# EAGLE design grizzly_bear (EAGLE 6.2)
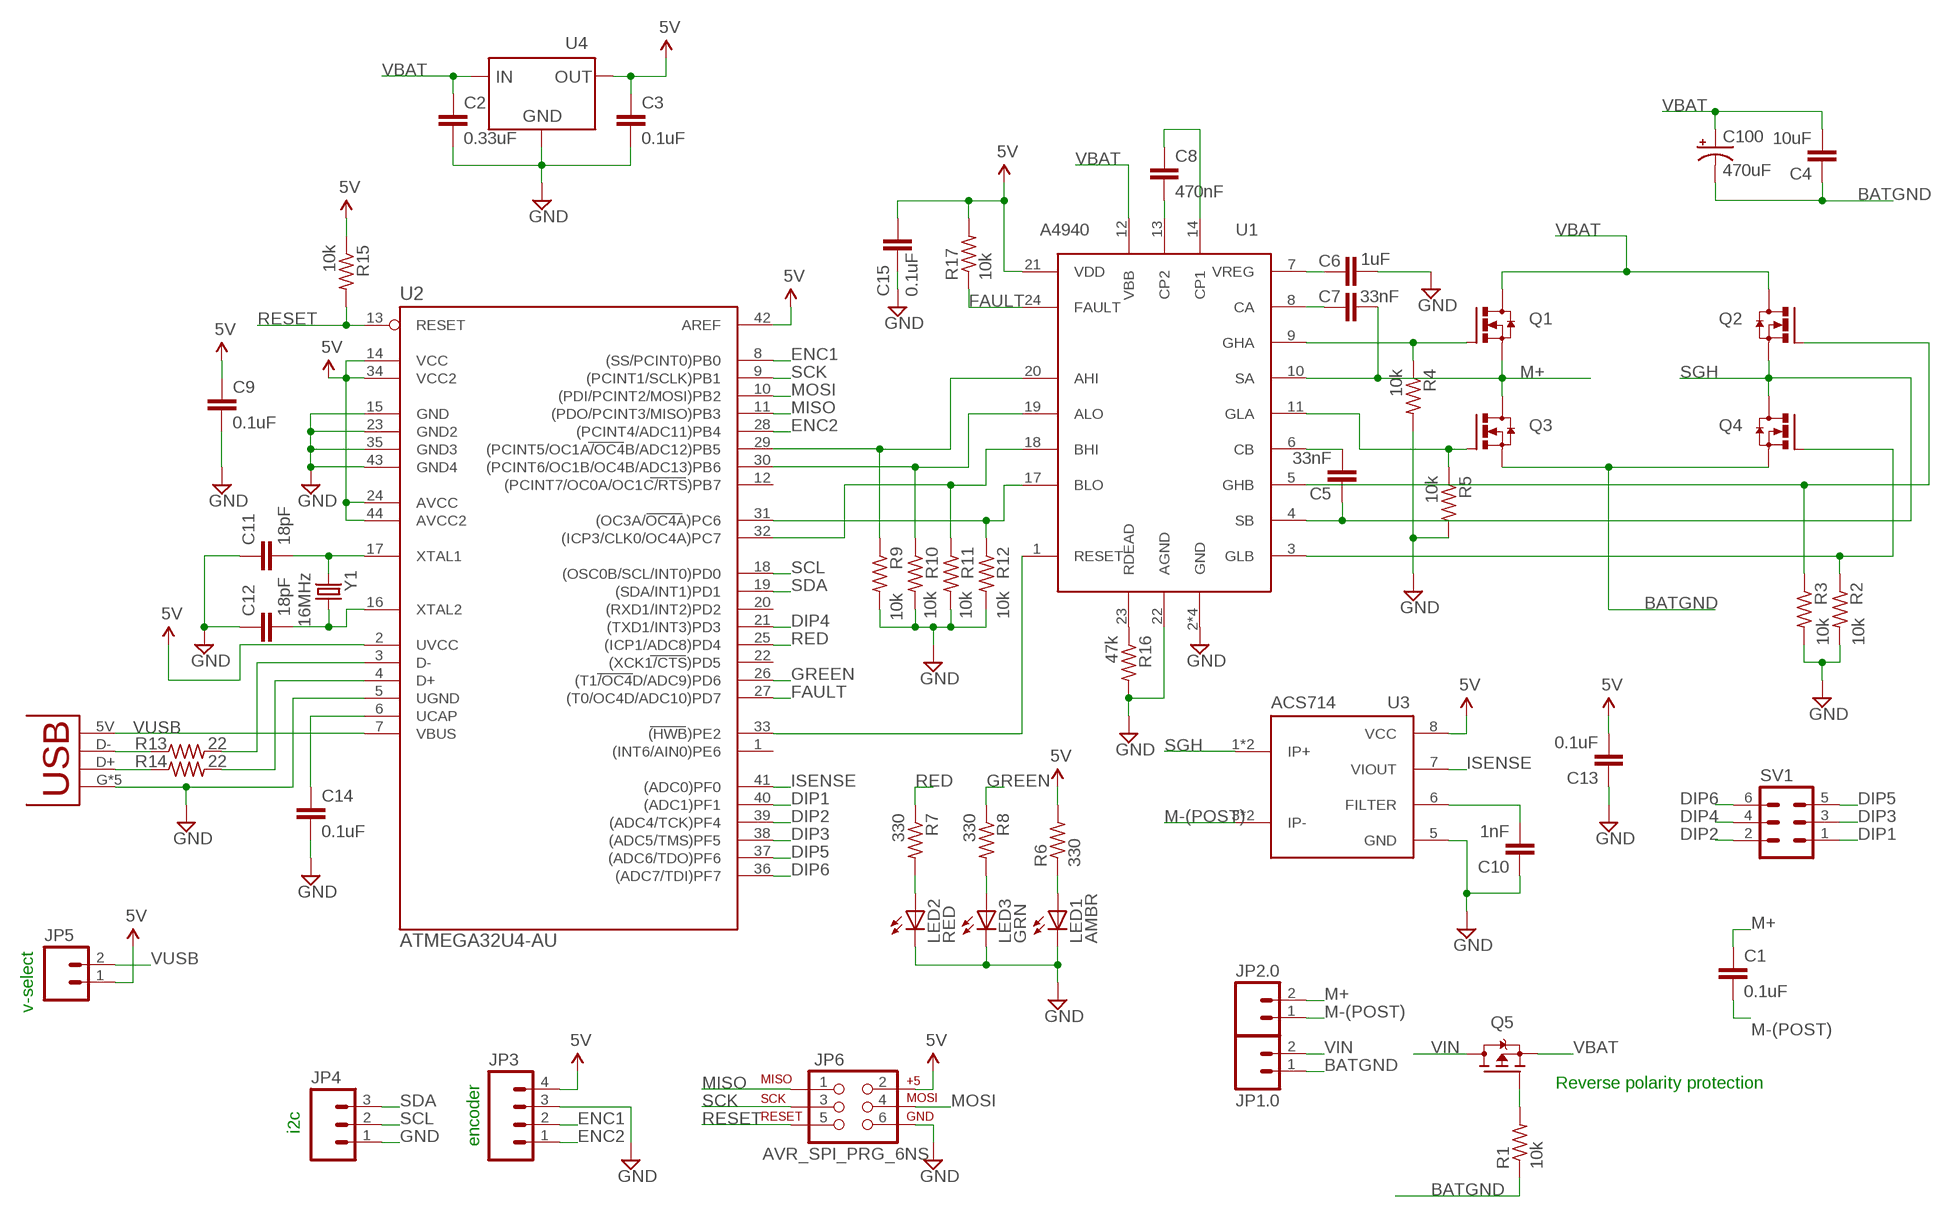
[diagram p0: schematic, sheet 1]

## Parts
C1  0.1uF  CAP0603-CAP  [0603-CAP]
C2  0.33uF  CAP0603-CAP  [0603-CAP]
C3  0.1uF  CAP0603-CAP  [0603-CAP]
C4  10uF  CAP0603-CAP  [0603-CAP]
C5  33nF  CAP0603-CAP  [0603-CAP]
C6  1uF  CAP0603-CAP  [0603-CAP]
C7  33nF  CAP0603-CAP  [0603-CAP]
C8  470nF  CAP0603-CAP  [0603-CAP]
C9  0.1uF  CAP0603-CAP  [0603-CAP]
C10  1nF  CAP0603-CAP  [0603-CAP]
C11  18pF  CAP0603-CAP  [0603-CAP]
C12  18pF  CAP0603-CAP  [0603-CAP]
C13  0.1uF  CAP0603-CAP  [0603-CAP]
C14  0.1uF  CAP0603-CAP  [0603-CAP]
C15  0.1uF  CAP0603-CAP  [0603-CAP]
C100  470uF  CAP_POLG  [PANASONIC_G]
JP1.0  M02PTH4  [1X02_XTRA_BIG]
JP2.0  M02PTH4  [1X02_XTRA_BIG]
JP3  M04POLAR  [MOLEX-1X4]
JP4  M03POLAR  [MOLEX-1X3]
JP5  M02LOCK  [1X02_LOCK]
JP6  AVR_SPI_PRG_6NS  [2X3-NS]
LED1  AMBR  LED1206  [LED-1206]
LED2  RED  LED1206  [LED-1206]
LED3  GRN  LED1206  [LED-1206]
Q1  N-CHANNEL-MOSFET  [SOT669]
Q2  N-CHANNEL-MOSFET  [SOT669]
Q3  N-CHANNEL-MOSFET  [SOT669]
Q4  N-CHANNEL-MOSFET  [SOT669]
Q5  IPD90P03P4L  P-CHANNEL-MOSFETTO252  [TO252]
R1  10k  R-US_R0603  [R0603]
R2  10k  R-US_R0603  [R0603]
R3  10k  R-US_R0603  [R0603]
R4  10k  R-US_R0603  [R0603]
R5  10k  R-US_R0603  [R0603]
R6  330  R-US_R0603  [R0603]
R7  330  R-US_R0603  [R0603]
R8  330  R-US_R0603  [R0603]
R9  10k  R-US_R0603  [R0603]
R10  10k  R-US_R0603  [R0603]
R11  10k  R-US_R0603  [R0603]
R12  10k  R-US_R0603  [R0603]
R13  22  R-US_R0603  [R0603]
R14  22  R-US_R0603  [R0603]
R15  10k  R-US_R0603  [R0603]
R16  47k  R-US_R0603  [R0603]
R17  10k  R-US_R0603  [R0603]
SV1  MA03-2  [MA03-2]
U1  A4940  [24-PIN_TSSOP]
U2  ATMEGA32U4-AU  [TQFP44]
U3  ACS714  [8-PIN_SOIC]
U4  UA78L00  [SOT-89-3]
U$2  USB-M26FTR  [USB-M26FTR]
Y1  16MHz  CRYSTALHC49US  [HC49US]

## Nets
5V: C3.1 C9.1 C13.2 C15.1 JP3.4 JP5.1 JP6.2 R6.2 R15.1 R17.2 U1.21(VDD) U2.2(UVCC) U2.14(VCC) U2.24(AVCC) U2.34(VCC2) U2.42(AREF) U2.44(AVCC2) U3.8(VCC) U4.OUTPUT(OUT)
AHI: R9.1 U1.20(AHI) U2.29((PCINT5/OC1A/OC4B/ADC12)PB5)
BATGND: C4.1 C100.- JP1.0.1 Q3.1(S) Q3.2(S) Q3.3(S) Q4.1(S) Q4.2(S) Q4.3(S) R1.1
DIP1: SV1.1 U2.40((ADC1)PF1)
DIP2: SV1.2 U2.39((ADC4/TCK)PF4)
DIP3: SV1.3 U2.38((ADC5/TMS)PF5)
DIP4: SV1.4 U2.21((TXD1/INT3)PD3)
DIP5: SV1.5 U2.37((ADC6/TDO)PF6)
DIP6: SV1.6 U2.36((ADC7/TDI)PF7)
ENC1: JP3.2 U2.8((SS/PCINT0)PB0)
ENC2: JP3.1 U2.28((PCINT4/ADC11)PB4)
FAULT: R17.1 U1.24(FAULT) U2.27((T0/OC4D/ADC10)PD7)
GND: C2.2 C3.2 C6.2 C9.2 C10.1 C11.1 C12.1 C13.1 C14.2 C15.2 JP3.3 JP4.1 JP6.6 LED1.C LED2.C LED3.C R2.2 R3.2 R4.2 R5.2 R9.2 R10.2 R11.2 R12.2 R16.2 U1.2(GND) U1.15(GND) U1.16(GND) U1.22(AGND) U1.PAD(GND) U2.5(UGND) U2.15(GND) U2.23(GND2) U2.35(GND3) U2.43(GND4) U3.5(GND) U4.COMMON(GND) U$2.G U$2.S1(G) U$2.S2(G) U$2.S3(G) U$2.S4(G)
GREEN: R8.1 U2.26((T1/OC4D/ADC9)PD6)
ISENSE: U2.41((ADC0)PF0) U3.7(VIOUT)
M+: C1.1 C7.2 JP2.0.2 Q1.1(S) Q1.2(S) Q1.3(S) Q3.MB(D) U1.10(SA)
M-(POST): C1.2 JP2.0.1 U3.3(IP-) U3.4(IP-)
MISO: JP6.1 U2.11((PDO/PCINT3/MISO)PB3)
MOSI: JP6.4 U2.10((PDI/PCINT2/MOSI)PB2)
N$1: Q5.1(G) R1.2
N$2: Q1.4(G) R4.1 U1.9(GHA)
N$3: C8.2 U1.13(CP2)
N$5: LED3.A R8.2
N$6: R16.1 U1.23(RDEAD)
N$7: R13.2 U2.3(D-)
N$8: Q3.4(G) R5.1 U1.11(GLA)
N$9: R14.2 U2.4(D+)
N$10: U1.1(RESET) U2.33((HWB)PE2)
N$11: Q4.4(G) R2.1 U1.3(GLB)
N$13: Q2.4(G) R3.1 U1.5(GHB)
N$14: C5.2 U1.6(CB)
N$16: C7.1 U1.8(CA)
N$17: C6.1 U1.7(VREG)
N$18: C14.1 U2.6(UCAP)
N$19: C8.1 U1.14(CP1)
N$20: R12.1 U1.17(BLO) U2.31((OC3A/OC4A)PC6)
N$21: R11.1 U1.18(BHI) U2.32((ICP3/CLK0/OC4A)PC7)
N$22: R10.1 U1.19(ALO) U2.30((PCINT6/OC1B/OC4B/ADC13)PB6)
N$23: LED2.A R7.2
N$24: R14.1 U$2.D+
N$25: LED1.A R6.1
N$26: C11.2 U2.17(XTAL1) Y1.2
N$27: C12.2 U2.16(XTAL2) Y1.1
N$28: C10.2 U3.6(FILTER)
N$29: R13.1 U$2.D-
RED: R7.1 U2.25((ICP1/ADC8)PD4)
RESET: JP6.5 R15.2 U2.13(RESET)
SCK: JP6.3 U2.9((PCINT1/SCLK)PB1)
SCL: JP4.2 U2.18((OSC0B/SCL/INT0)PD0)
SDA: JP4.3 U2.19((SDA/INT1)PD1)
SGH: C5.1 Q2.1(S) Q2.2(S) Q2.3(S) Q4.MB(D) U1.4(SB) U3.1(IP+) U3.2(IP+)
VBAT: C2.1 C4.2 C100.+ Q1.MB(D) Q2.MB(D) Q5.2(S) U1.12(VBB) U4.INPUT(IN)
VIN: JP1.0.2 Q5.3(D)
VUSB: JP5.2 U2.7(VBUS) U$2.5V
Unconnected: U2.1((INT6/AIN0)PE6) U2.12((PCINT7/OC0A/OC1C/RTS)PB7) U2.20((RXD1/INT2)PD2) U2.22((XCK1/CTS)PD5)

## Notes on the sheet
- v-select
- Reverse polarity protection
- i2c
- encoder

## Library data of the parts
C1-C15 = pie:CAP: Capacitor Standard 0603 ceramic capacitor, and 0.1" leaded capacitor.
C100 = pie:CAP_POL: Capacitor Polarized These are standard SMD and PTH capacitors. Normally 10uF, 47uF, and 100uF in electrolytic and tantalum varieties. Always verify the external diameter of the through hole cap, it varies with capacity, voltage, and manufacturer. The EIA devices should be standard.
JP1.0 JP2.0 JP5 = pie:M02: Header 2 Standard 2-pin 0.1" header. Use with straight break away headers (SKU : PRT-00116), right angle break away headers (PRT-00553), swiss pins (PRT-00743), machine pins (PRT-00117), and female headers (PRT-00115). Molex polarized connector foot print use with SKU : PRT-08233 with associated crimp pins and housings.
JP3 = pie:M04: Header 4 Standard 4-pin 0.1" header. Use with straight break away headers (SKU : PRT-00116), right angle break away headers (PRT-00553), swiss pins (PRT-00743), machine pins (PRT-00117), and female headers (PRT-00115). Molex polarized connector foot print use with SKU : PRT-08231 with associated crimp pins and housings. 1MM SMD Version SKU: PRT-10208
JP4 = pie:M03: Header 3 Standard 3-pin 0.1" header. Use with straight break away headers (SKU : PRT-00116), right angle break away headers (PRT-00553), swiss pins (PRT-00743), machine pins (PRT-00117), and female headers (PRT-00115). Molex polarized connector foot print use with SKU : PRT-08232 with associated crimp pins and housings.
JP6 = pie:AVR_SPI_PRG_6: AVR ISP 6 Pin This is the reduced ISP connector for AVR programming. Common on Arduino. This footprint will take up less PCB space and can be used with a 10-pin to 6-pin adapter such as SKU: BOB-08508
LED1-LED3 = pie:LED: LEDs Standard schematic elements and footprints for 5mm, 3mm, 1206, and 0603 sized LEDs. 5mm - Spark Fun Electronics SKU : COM-00529 (and others)
Q1-Q4 = pie:N-CHANNEL-MOSFET: N-channel TrenchMOS (TM) logic level FET Source: http://www.nxp.com/acrobat_download/datasheets/PH7030L_4.pdf; PIE-DIGIKEY-PN-PRI: 568-6738-1-ND
Q5 = pie:P-CHANNEL-MOSFET: P-Channel PowerTrench® MOSFET Source: FDD4141.pdf; PIE-DIGIKEY-PN-PRI: IPD90P03P4L-04INCT-ND
R1-R17 = pie:R-US_: RESISTOR, American symbol
SV1 = pie:MA03-2: PIN HEADER; OC_FARNELL: unknown; OC_NEWARK: unknown
U1 = pie:A4940; PIE-DIGIKEY-PN-PRI: 620-1319-1-ND
U2 = pie:ATMEGA32U4-AU; PIE-DIGIKEY-PN-ALT1: ATMEGA32U4-MURCT-ND; PIE-DIGIKEY-PN-PRI: ATMEGA32U4RC-MURCT-ND
U3 = pie:ACS714; PIE-DIGIKEY-PN-PRI: 620-1260-1-ND
U4 = pie:UA78L00; PIE-DIGIKEY-PN-PRI: 296-11118-1-ND
U$2 = pie:USB-M26FTR
Y1 = pie:CRYSTAL: Various standard crystals. Proven footprints. Spark Fun Electronics SKU : COM-00534

## Board
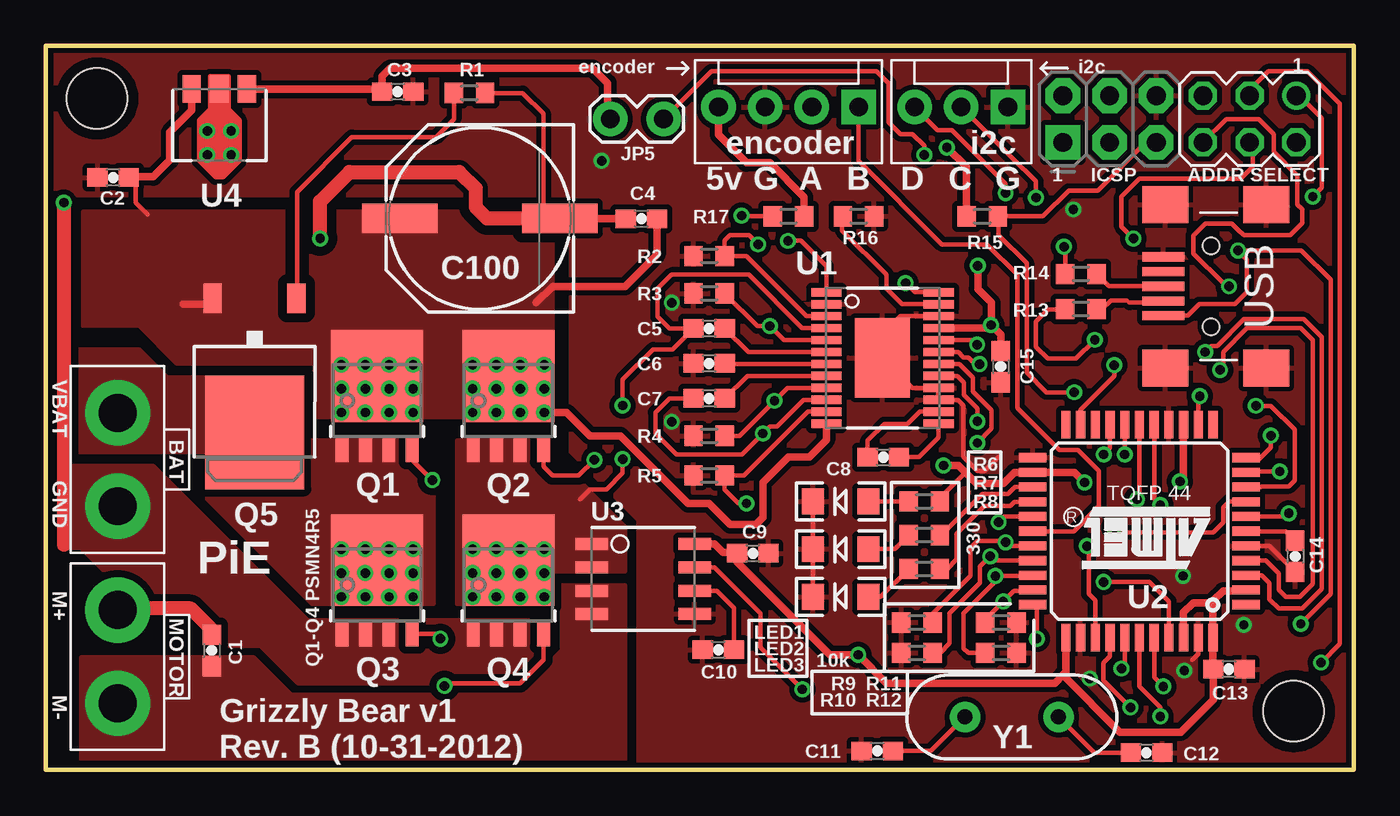
[diagram p1: board, top side]
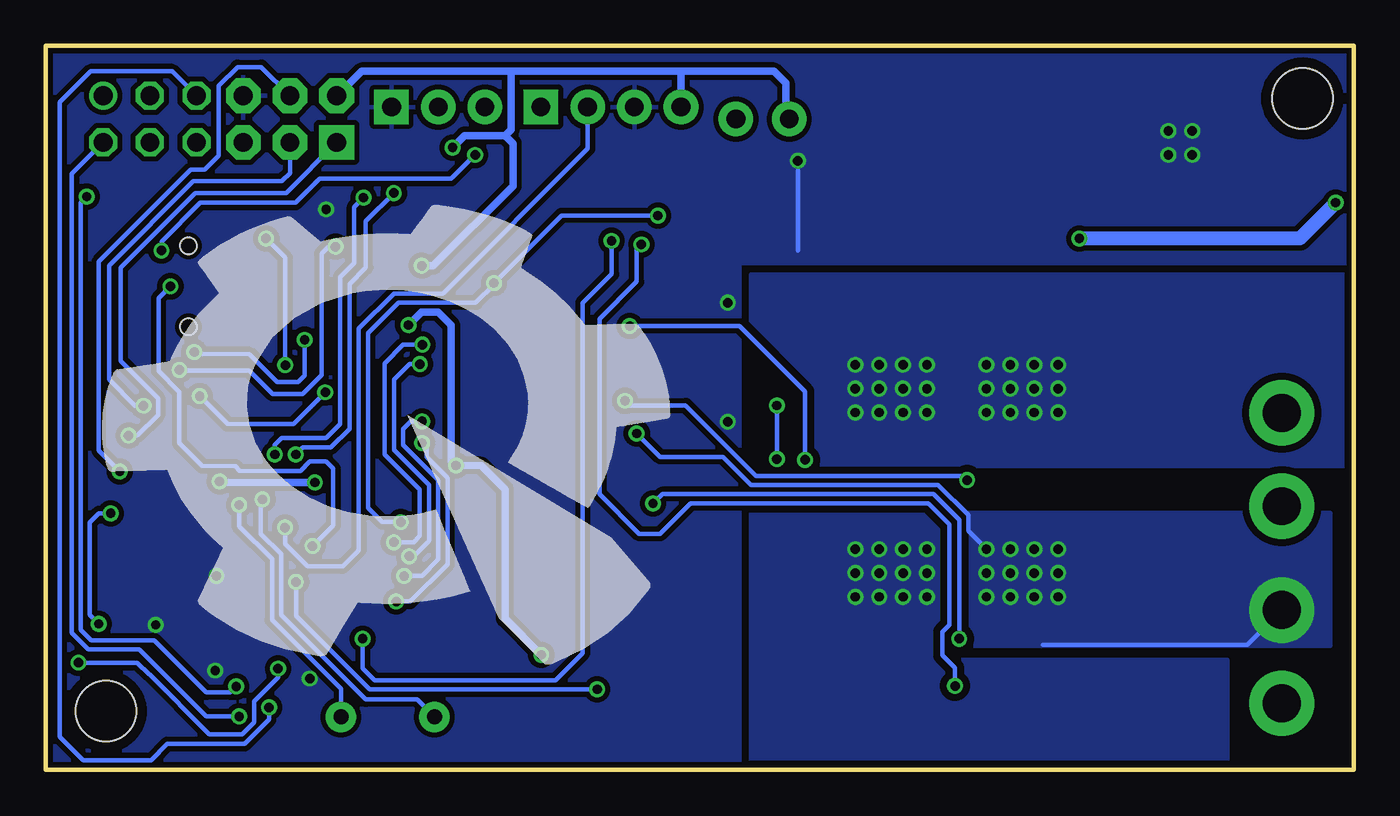
[diagram p2: board, bottom side, seen from below]

Size 71.12 x 39.37 mm. Coordinates in mm from the lower left corner, seen from the top.
Outline: 0,0 71.12,0 71.12,39.37 0,39.37 0,0
Copper layers (1*16): Top 2mil / dielectric 9mil / Bottom 2mil
Design rules: minimum track width 6mil, minimum drill 15mil, track to track 6mil, track to pad 10mil, pad to pad 6mil, via to via 6mil, smd to smd 6mil, copper to edge 10mil, drill to drill 7mil, minimum pad ring 7mil, minimum via ring 7mil, stop-mask expansion 3mil, vias tented up to drill 0mil, thermal gap 10mil

### Footprints (pad centres in the part's own frame; a part is rotated, then mirrored left to right if it is on the bottom)
0603-CAP = smd 1.1 x 1: 1 -0.85,0; 2 0.85,0
PANASONIC_G = smd 4.1 x 1.6: + 4.35,0; - -4.35,0
1X02_XTRA_BIG = drill 2.057 pad 3.556: 1 -2.54,0; 2 2.54,0
MOLEX-1X4 = drill 1.016 pad 1.88 square: 1 0,0 | drill 1.016 pad 1.88: 2 2.54,0; 3 5.08,0; 4 7.62,0
MOLEX-1X3 = drill 1.016 pad 1.88 square: 1 0,0 | drill 1.016 pad 1.88: 2 2.54,0; 3 5.08,0
1X02_LOCK = drill 1.016 pad 1.88: 1 -0.178,0; 2 2.718,0
2X3-NS = drill 1.016 pad 1.88 square: 1 -2.54,-1.27 | drill 1.016 pad 1.88 octagon: 2 -2.54,1.27; 3 0,-1.27; 4 0,1.27; 5 2.54,-1.27; 6 2.54,1.27
LED-1206 = smd 1.2 x 1.4: A -1.5,0; C 1.5,0
SOT669 = smd 0.7 x 1.4: 1 -1.905,-2.65; 2 -0.635,-2.65; 3 0.635,-2.65; 4 1.905,-2.65 | smd 5 x 5: MB 0,1.35
TO252 = smd 1 x 1.6: 1 -2.28,-4.8; 2 2.28,-4.8 | smd 5.4 x 6.2: 3 0,2.5
R0603 = smd 1 x 1.1: 1 -0.85,0; 2 0.85,0
MA03-2 = drill 1.016: 1 -2.54,-1.27 | drill 1.016 octagon: 2 -2.54,1.27; 3 0,-1.27; 4 0,1.27; 5 2.54,-1.27; 6 2.54,1.27
24-PIN_TSSOP = smd 1.65 x 0.45: 1 -3.05,3.575; 2 -3.05,2.925; 3 -3.05,2.275; 4 -3.05,1.625; 5 -3.05,0.975; 6 -3.05,0.325; 7 -3.05,-0.325; 8 -3.05,-0.975; 9 -3.05,-1.625; 10 -3.05,-2.275; 11 -3.05,-2.925; 12 -3.05,-3.575; 13 3.05,-3.575; 14 3.05,-2.925; 15 3.05,-2.275; 16 3.05,-1.625; 17 3.05,-0.975; 18 3.05,-0.325; 19 3.05,0.325; 20 3.05,0.975; 21 3.05,1.625; 22 3.05,2.275; 23 3.05,2.925; 24 3.05,3.575 | smd 3 x 4.32: PAD 0,0
TQFP44 = smd 1.5 x 0.5: 1 -5.8,4; 2 -5.8,3.2; 3 -5.8,2.4; 4 -5.8,1.6; 5 -5.8,0.8; 6 -5.8,0; 7 -5.8,-0.8; 8 -5.8,-1.6; 9 -5.8,-2.4; 10 -5.8,-3.2; 11 -5.8,-4; 23 5.8,-4; 24 5.8,-3.2; 25 5.8,-2.4; 26 5.8,-1.6; 27 5.8,-0.8; 28 5.8,0; 29 5.8,0.8; 30 5.8,1.6; 31 5.8,2.4; 32 5.8,3.2; 33 5.8,4 | smd 0.5 x 1.5: 12 -4,-5.8; 13 -3.2,-5.8; 14 -2.4,-5.8; 15 -1.6,-5.8; 16 -0.8,-5.8; 17 0,-5.8; 18 0.8,-5.8; 19 1.6,-5.8; 20 2.4,-5.8; 21 3.2,-5.8; 22 4,-5.8; 34 4,5.8; 35 3.2,5.8; 36 2.4,5.8; 37 1.6,5.8; 38 0.8,5.8; 39 0,5.8; 40 -0.8,5.8; 41 -1.6,5.8; 42 -2.4,5.8; 43 -3.2,5.8; 44 -4,5.8
8-PIN_SOIC = smd 1.75 x 0.65: 1 -2.8,1.905; 2 -2.8,0.635; 3 -2.8,-0.635; 4 -2.8,-1.905; 5 2.8,-1.905; 6 2.8,-0.635; 7 2.8,0.635; 8 2.8,1.905
SOT-89-3 = smd 1 x 1.5: COMMON 0,-3.9; INPUT 1.5,-3.9; OUTPUT -1.5,-3.9
USB-M26FTR = smd 0.5 x 2.3: 5V -1.6,0; D+ 0,0; D- -0.8,0; G 1.6,0; NC 0.8,0 | smd 2 x 2.5: S1 4.45,-0.1; S2 4.45,-5.6; S3 -4.45,-0.1; S4 -4.45,-5.6 | hole 0.9: 2.2,-2.6; -2.2,-2.6
STAND-OFF = hole 3.302: 0,0
HC49US = drill 0.82 pad 1.651: 1 -2.54,0; 2 2.54,0

### Placement (x,y rotation side)
C1  9.02,6.48 270 top
C2  3.65,32.21 180 top
C3  19.13,36.88 0 top
C4  32.38,29.97 0 top
C5  36.07,24 0 top
C6  36.07,22.1 180 top
C7  36.07,20.19 180 top
C8  45.54,17 0 top
C9  38.45,11.77 0 top
C10  36.57,6.52 0 top
C11  45.21,1.02 0 top
C12  59.86,0.92 180 top
C13  64.34,5.47 180 top
C14  67.95,11.61 270 top
C15  51.93,21.92 270 top
C100  23.6,29.98 180 top
JP1.0  3.9,16.87 90 top
JP2.0  3.9,6.14 90 top
JP3  44.2,36.05 180 top
JP4  52.33,36.05 180 top
JP5  30.88,35.4 0 top
JP6  57.85,35.4 0 top
LED1  43.23,14.6 180 top
LED2  43.23,11.99 180 top
LED3  43.23,9.39 180 top
Q1  18.02,20.07 0 top
Q2  25.15,20.07 0 top
Q3  18.02,10.04 0 top
Q4  25.15,10.04 0 top
Q5  11.35,20.84 180 top
R1  23.04,36.81 180 top
R2  36.07,27.94 180 top
R3  36.07,25.91 180 top
R4  36.07,18.16 180 top
R5  36.07,16 180 top
R6  47.78,14.6 0 top
R7  47.78,12.76 180 top
R8  47.78,10.92 180 top
R9  47.37,8 180 top
R10  47.37,6.35 180 top
R11  51.94,8 0 top
R12  51.94,6.35 0 top
R13  56.29,25.05 180 top
R14  56.29,26.96 180 top
R15  50.93,30.1 0 top
R16  44.2,30.1 0 top
R17  40.39,30.1 0 top
SV1  65.47,35.4 180 top
U1  45.5,22.39 0 top
U2  59.48,12.97 180 top
U3  32.48,10.37 0 top
U4  9.43,33.12 180 top
U$2  60.77,26.3 90 top
U$15  [STAND-OFF]  2.78,36.51 0 top
U$16  [STAND-OFF]  67.87,3.17 0 top
U$17  [PIE-LOGO]  51.56,19.05 0 bottom
Y1  52.53,2.86 180 top

### Tracks (layer width: path | path; a pad name or v marks a point on that pad's centre or on a via)
5V  (via drill 0.51)
  Top 0.254: R6.2 48.75,14.6 48.75,14.92 50,16.17 | U2.34 55.58,7.07 | 63.48,9.07 63.48,9.17 | 65.22,9.72 U2.2 | R15.1 50.08,30.45 50.05,30.48 | 18.29,36.89 18.29,36.96 18.4,37.07
  Top 0.406: v48.82,16.55 49.62,16.55 50,16.17 50.6,15.57 52.07,15.57 52.67,16.17 U2.24 55.95,16.17 v56.49,15.62 | 63.48,9.17 64.03,9.72 65.22,9.72 | U2.42 61.88,8.54 62.4,9.07 63.48,9.07 U2.44 63.48,5.48 C13.2 63.49,3.8 61.72,2.03 58.42,2.03 55.31,5.14 | JP5.1 30.55,35.54 30.55,37.34 29.74,38.16 18.73,38.16 18.29,37.72 18.29,36.89 C3.1 18.14,37.02 U4.OUTPUT | 18.4,37.02 18.4,37.07 | C15.1 51.93,23.66 v51.41,24.18 | 44.28,6.35 v44.18,6.25 | U2.34 55.48,5.31 55.31,5.14 | 55.31,5.14 54.86,4.7 45.73,4.7 v44.18,6.25 | 50.05,30.48 50.05,32.8 v49,33.84 | R17.2 41.24,31.15 39.37,33.02 38.1,33.02 36.58,34.54 JP3.4 | v50.68,27.41 50.68,26.16 51.44,25.4 51.44,24.21 v51.41,24.18 | U2.14 61.88,15.87 v61.68,15.68 | v44.18,6.25 42.65,6.25 37.6,11.3 C9.1 37.56,11.81 36.83,11.81 36.37,12.28 U3.8 | U1.21 51.24,24.02 v51.41,24.18
  Bottom 0.254: 55.25,36.7 55.28,36.7 JP6.2 | 36.58,37.85 36.73,37.99
  Bottom 0.406: 45.83,37.99 36.73,37.99 31.52,37.99 30.88,37.34 30.88,35.57 JP5.1 | 45.83,37.99 53.95,37.99 55.25,36.7 | 45.83,37.99 45.83,34.82 46.15,34.49 | JP3.4 36.58,37.85 | v44.18,6.25 46.15,8.22 46.15,15.24 47.45,16.55 v48.82,16.55 49.08,16.8 49.08,24.18 49.78,24.89 50.7,24.89 v51.41,24.18 | 46.15,34.49 45.72,34.06 45.72,31.75 50.06,27.41 v50.68,27.41 | v56.49,15.62 61.62,15.62 v61.68,15.68 | 46.15,34.49 48.35,34.49 v49,33.84
AHI  (via drill 0.51)
  Top 0.254: U2.29 52.4,12.17 v52.2,12.37 52.12,12.45 50.67,12.45 50.29,12.06 50.29,10.54 48.22,8.47 R9.1 | U1.20 50.39,23.37 v50.65,23.12
  Bottom 0.254: v52.2,12.37 51.13,12.37 50.8,12.7 50.8,15.24 52.7,17.14 52.7,22.1 51.69,23.12 v50.65,23.12
BATGND  (via drill 0.51)
  Top 0.254: R1.1 25.93,36.81 27.05,35.69 27.05,29.98 | C100.-
  Top 0.406: C4.1 C100.-
  Top 0.762: v0.97,30.84 0.97,12.25 | v14.91,28.89 14.91,30.91 16.51,32.51 22.48,32.51 23.37,31.62 23.37,30.61 23.99,29.98 27.05,29.98 C100.-
  Bottom 0.762: v0.97,30.84 2.92,28.89 v14.91,28.89
  pour Top (isolate 0.381, no thermals): 5.84,16.51 0.76,16.51 0.76,12.06 1.91,12.06 7.24,6.73 11.68,6.73 13.72,4.7 24.89,4.7 26.42,6.22 26.42,8.13 14.22,8.13
DIP1  (via drill 0.51)
  Top 0.254: U2.40 60.27,5.02 v60.77,4.52 | v68.9,31.17 69.39,31.66 69.39,35.45 68.17,36.66 SV1.1
  Bottom 0.254: v60.77,4.52 61.1,4.2 62.4,4.2 65.24,7.03 68.65,7.03 69.22,7.61 69.22,30.84 v68.9,31.17
DIP2  (via drill 0.51)
  Top 0.254: U2.39 59.48,4.52 60.61,3.38 v60.61,2.9 | U2.39
  Bottom 0.254: v60.61,2.9 62.4,2.9 66.05,6.55 68.81,6.55 69.71,7.45 69.71,32.42 SV1.2
DIP3  (via drill 0.51)
  Top 0.254: U2.38 58.67,5.67 v58.5,5.5 | SV1.3 65.47,36.99 66.47,37.99 68.61,37.99 70.36,36.24 70.36,6.83 v69.35,5.82
  Bottom 0.254: v58.5,5.5 58.5,5.01 59.8,3.71 59.8,2.57 60.45,1.92 62.24,1.92 65.49,5.17 65.5,5.17 66.14,5.82 v69.35,5.82
DIP4  (via drill 0.51)
  Top 0.254: v59.15,28.89 58.5,29.55 58.5,31.17 59.48,32.15 65,32.15 65.65,32.8 65.65,33.98 65.5,34.12 SV1.4 | U2.21 56.27,19.57 58.1,21.4 v58.1,22
  Bottom 0.254: v58.1,22 58.1,27.85 v59.15,28.89
DIP5  (via drill 0.51)
  Top 0.254: U2.37 57.88,6.17 57.52,5.82 57.52,4.84 v58.99,3.38
  Bottom 0.254: v58.99,3.38 58.99,2.73 60.32,1.4 64.52,1.4 65.41,0.51 69.09,0.51 70.36,1.78 70.36,36.32 68.69,37.99 64.26,37.99 SV1.5
DIP6  (via drill 0.51)
  Top 0.254: U2.36 57.08,9.2 56.71,9.56 56.71,12.07 v56.62,12.16 | v64.35,26.3 64.19,26.46 64.03,26.46 62.4,28.08 62.4,29.06 63.05,29.71 64.51,29.71 65,29.22 65.01,29.22 65.15,29.08 67.69,29.08 68.33,29.72 68.33,30.48 68.07,30.73 68.07,32.32 66.79,33.61 66.79,34.58 65.97,35.4 64.2,35.4 SV1.6
  Bottom 0.254: v64.35,26.3 65,25.64 65,21.69 63.86,20.56 63.86,17.76 62.61,16.51 60.83,16.51 60.58,16.26 57.28,16.26 56.77,16.76 55.88,16.76 55.5,16.38 55.5,13.28 v56.62,12.16
ENC1  (via drill 0.51)
  Top 0.254: U2.8 65.25,14.6 64.35,14.6 64.03,14.27 64.03,13.46 63.48,12.91 58.37,12.91 v58.12,13.17
  Bottom 0.254: JP3.2 41.66,33.78 49.53,25.91 52.2,25.91 54.1,24 54.1,11.94 54.99,11.05 56.9,11.05 58.12,12.27 v58.12,13.17
ENC2
  Top 0.254: 53.14,12.97 U2.28 55.9,12.97 57.28,14.35 57.28,16.26 56.13,17.4 55.12,17.4 52.83,19.68 52.83,26.92 51.18,28.57 48.74,28.57 44.2,33.12 JP3.1
FAULT  (via drill 0.51)
  Top 0.254: U1.24 47.26,25.97 v46.75,26.47 | U2.27 52.12,13.77 v51.82,13.46 | R17.1 37.88,30.1 v37.84,30.14
  Bottom 0.254: v37.84,30.14 43.08,30.14 v46.75,26.47 46.75,26.4 47.75,25.4 51.94,25.4 53.59,23.75 53.59,14.22 52.83,13.46 v51.82,13.46
GND  (via drill 0.51)
  Top 0.254: 45.5,24.02 45.5,23.7 | 45.5,23.7 U1.PAD | 45.5,23.7 46.48,24.67 U1.22 | v30.23,33.12 30.23,33.28 | LED3.C LED2.C LED1.C 41.73,14.72 | U1.PAD 44.85,22.39 44.52,22.07 44.85,21.75 | U1.PAD 45.99,21.91 | 45.99,21.91 47.12,20.77 U1.16 U1.15 49.6,20.12 49.91,19.81 49.91,17.02 50.67,16.26 51.05,16.26 51.82,17.02 | 45.83,21.42 45.99,21.58 45.99,21.91 | 65.22,30.09 65.33,30.2 65.83,30.2 U$2.S2 | U$2.G 60.88,28 | 61.1,18.8 U2.15 | 65.45,21.09 65.88,21.52 66.05,21.52 66.2,21.67 66.38,21.67 66.62,21.42 67.28,21.42 | U2.5 66.53,12.17 C14.2 | U2.23 53.52,16.97 | U2.43 62.67,6.29 62.36,5.97
  Bottom 0.254: v30.23,33.12 30.23,28.25
  other vias: 61.91,5.39 8.78,33.45 10.07,34.74 10.07,33.45 8.78,34.74 61.85,10.54 56.77,4.95 34.04,25.4 34.04,18.92 65.15,7.87 55.88,30.48
  pour Top (isolate 0.279): 32.26,0 32.26,13.59 28.57,17.27 28.57,31.24 0,31.24 0,39.37 71.12,39.37 71.12,0
  pour Bottom (isolate 0.279): 33.4,0 33.4,27.56 0,27.56 0,39.37 71.12,39.37 71.12,0
GREEN
  Top 0.254: U2.26 52.67,14.57 52.45,14.35 51.05,14.35 49.53,12.83 49.53,11.43 49.02,10.92 R8.1
ISENSE  (via drill 0.51)
  Top 0.254: v57.52,10.21 60.02,10.21 61.08,9.16 U2.41 | U3.7 36.37,11.01 38.86,8.51 38.86,6.64 v41.14,4.37
  Bottom 0.254: v41.14,4.37 41.15,4.36 53.51,4.36 57.52,8.38 v57.52,10.21
M+  (via drill 0.51)
  Top 0.254: U1.10 41.2,20.12 39.75,18.67 39.37,18.67 v38.99,18.29 37.85,17.14 34.29,17.14 33.15,18.29 33.15,19.43 33.91,20.19 C7.2
  Top 0.762: C1.1 9.02,7.62 7.87,8.76 3.98,8.76 JP2.0.2
  Bottom 0.254: 16.9,6.79 5.79,6.79 JP2.0.2 | v19.97,11.99 20.95,12.98 20.95,13.84 22.61,15.49 32.77,15.49 34.29,17.02 37.72,17.02 v38.99,18.29
  other vias: 16.07,9.39 17.37,9.39 18.67,9.39 19.97,9.39 16.07,10.7 17.37,10.7 18.67,10.7 19.97,10.7 16.07,11.99 17.37,11.99 18.67,11.99
  pour Top (isolate 0.381, no thermals): 6.99,16.51 14.48,9.02 21.08,9.02 21.08,17.91 14.35,17.91 14.35,16.51
  pour Bottom (isolate 0.381, no thermals): 20.95,13.97 1.27,13.97 1.27,6.73 20.95,6.73
M-(POST)
  pour Top (isolate 0.381, no thermals): 1.91,6.1 11.3,6.1 13.34,4.06 25.65,4.06 28.07,6.48 28.07,10.03 31.5,10.03 31.5,0 1.91,0
MISO  (via drill 0.51)
  Top 0.254: U2.11 65.38,16.87 65.97,16.87 66.62,17.52 v66.62,18.17
  Bottom 0.254: v66.62,18.17 66.16,18.17 65.02,19.3 65.02,20.19 67.06,22.23 67.06,27.3 62.99,31.37 58.07,31.37 JP6.1
MOSI  (via drill 0.51)
  Top 0.254: U2.10 65.33,16.22 v67.11,16.22
  Bottom 0.254: v67.11,16.22 68.25,17.36 68.25,27.64 63.25,32.64 62.48,32.64 61.72,33.4 61.72,37.21 60.71,38.23 59.41,38.23 JP6.4
N$1
  Top 0.254: Q5.1 13.65,25.66 13.65,31.43 16.64,34.42 21.21,34.42 22.18,35.39 R1.2
N$2  (via drill 0.51)
  Top 0.254: U1.9 40.33,20.77 v39.62,20.07 37.72,18.16 R4.1 | Q1.4 19.92,16.84 v21.01,15.75
  Bottom 0.254: v39.62,20.07 39.37,19.81 36.32,19.81 32.5,15.99 21.25,15.99 v21.01,15.75
N$3
  Top 0.254: C8.2 47.48,17 48.55,18.07 U1.13
N$5
  Top 0.254: LED3.A 45.4,9.39 R8.2
N$6
  Top 0.254: U1.23 46.56,25.32 45.72,26.16 45.72,26.92 43.31,29.34 43.31,30.06 R16.1
N$7  (via drill 0.51)
  Top 0.254: v63.05,22.72 63.38,23.05 63.7,23.05 65.16,24.51 68.41,24.51 69.39,23.53 69.39,9.82 68.33,8.76 67.06,8.76 66.55,9.27 66.55,10.16 66.14,10.57 U2.3 | R13.2 arc-90 55.4,25.02 54.48,25.02 53.85,24.38 53.85,22.99 54.48,22.35 56.02,22.35 v57.05,23.38
  Bottom 0.254: v63.05,22.72 62.94,22.61 60.07,22.61 58.55,21.08 57.4,21.08 57.05,21.44 v57.05,23.38
N$8  (via drill 0.51)
  Top 0.254: Q3.4 21.18,7.39 v21.45,7.12 | U1.11 41.44,19.47 37.97,16 R5.1 36.92,15.24 37.68,14.48 v38.1,14.48
  Bottom 0.254: v21.45,7.12 21.45,13.58 22.86,14.99 37.59,14.99 v38.1,14.48
N$9  (via drill 0.51)
  Top 0.254: 65.25,11.35 U2.4 66.35,11.37 67.06,10.67 67.06,9.78 67.44,9.4 68.2,9.4 68.9,10.1 68.9,23.37 68.25,24.02 65.33,24.02 64.03,22.72 64.03,21.91 v63.86,21.75 | R14.2 55.44,28.38 v55.37,28.45
  Bottom 0.254: v63.86,21.75 63.84,21.72 60.07,21.72 58.8,20.45 57.15,20.45 56.13,21.46 56.13,28.07 55.75,28.45 v55.37,28.45
N$10  (via drill 0.51)
  Top 0.254: 42.45,26.17 U1.1 42.45,27.39 41.08,28.77 v40.36,28.77 | v53.89,7.12 53.89,8.75 U2.33
  Bottom 0.254: v40.36,28.77 40.36,26.95 41.92,25.39 41.92,6.33 43.41,4.84 53.23,4.84 53.89,5.51 v53.89,7.12
N$11  (via drill 0.51)
  Top 0.254: U1.3 41.37,24.67 38.1,27.94 R2.1 36.92,28.79 37.21,29.08 38.23,29.08 v38.73,28.57 | Q4.4 27.06,5.97 25.78,4.7 21.83,4.7 v21.68,4.55
  Bottom 0.254: v21.68,4.55 21.68,5.55 22.35,6.22 22.35,7.49 21.97,7.87 21.97,13.34 23.11,14.48 36.07,14.48 37.72,12.83 38.86,12.83 41.02,14.99 41.02,24.51 38.99,26.54 38.99,28.32 v38.73,28.57
N$13  (via drill 0.51)
  Top 0.254: Q2.4 27.06,16.5 27.56,16 28.98,16 v29.83,16.86 | U1.5 40.13,23.37 v39.37,24.13 38.7,24.13 R3.1 36.96,25.91
  Bottom 0.254: v39.37,24.13 33.4,24.13 29.83,20.56 v29.83,16.86
N$14
  Top 0.254: U1.6 38.2,22.72 C5.2
N$16
  Top 0.254: U1.8 38.15,21.42 C7.1
N$17
  Top 0.254: U1.7 36.95,22.07 C6.1
N$18
  Top 0.254: U2.6 67.43,12.97 C14.1
N$19
  Top 0.254: C8.1 44.69,17.9 45.59,18.8 46.86,18.8 47.54,19.47 U1.14
N$20  (via drill 0.51)
  Top 0.254: U2.31 53.64,10.53 v51.64,10.53 51.64,10.24 49.91,8.51 49.91,6.6 50.16,6.35 R12.1 | U1.17 49.57,21.42 49.94,21.06 49.94,20.37 50.66,19.64 v50.66,18.95
  Bottom 0.254: v51.64,10.53 51.63,10.54 50.67,10.54 49.78,11.43 49.78,15.75 51.69,17.65 51.69,18.54 51.28,18.95 v50.66,18.95
N$21  (via drill 0.51)
  Top 0.254: U2.32 53.62,9.72 52.65,9.72 v52.07,9.14 51.35,8.42 51.09,8.42 R11.1 | U1.18 49.69,22.07 50.42,21.34 50.42,20.57 51.44,19.56 51.44,18.55 v50.66,17.77
  Bottom 0.254: v52.07,9.14 51.31,9.14 49.28,11.18 49.28,15.88 50.42,17.02 50.42,17.53 v50.66,17.77
N$22  (via drill 0.51)
  Top 0.254: U1.19 49.62,22.72 49.91,22.43 50.16,22.43 50.53,22.06 v50.79,22.06 | U2.30 51.59,11.37 v51.36,11.6 | 51.05,11.3 v51.36,11.6 | v51.36,11.6 50.8,11.04 50.8,10.16 49.15,8.51 49.15,6.86 48.64,6.35 R10.1
  Bottom 0.254: v51.36,11.6 51.13,11.6 50.29,12.45 50.29,15.49 52.2,17.4 52.2,21.21 51.35,22.06 v50.79,22.06
N$23
  Top 0.254: LED2.A 46.16,11.99 R7.2
N$24
  Top 0.254: U$2.D+ 57.81,26.3 R14.1
N$25
  Top 0.254: LED1.A R6.1
N$26  (via drill 0.51)
  Top 0.254: U2.17 59.48,14.83 v59.35,14.7 | C11.2 48.14,1.02 Y1.2
  Bottom 0.254: Y1.2 50.94,3.81 53.72,3.81 58.34,8.43 58.34,11.73 59.44,12.83 59.44,14.61 v59.35,14.7
N$27  (via drill 0.51)
  Top 0.254: 60.29,19.11 60.27,19.09 U2.16 60.27,14.73 v60.61,14.4 | C12.2 57.01,0.93 Y1.1
  Bottom 0.254: v60.61,14.4 60.61,13.24 58.83,11.45 58.83,8.15 55.07,4.4 Y1.1
N$28
  Top 0.254: C10.2 37.42,8.8 36.49,9.73 U3.6
N$29
  Top 0.254: R13.1 57.44,25.05 57.91,25.53 58.8,25.53 58.93,25.4 60.68,25.4 U$2.D-
RED
  Top 0.254: U2.25 52.7,15.37 52.32,14.99 50.93,14.99 48.62,12.68 R7.1
RESET  (via drill 0.51)
  Top 0.254: v62.76,20.32 62.67,20.23 U2.13 | JP6.5 59.83,34.12 57.2,31.5 55.63,31.5 54.23,30.1 R15.2 51.82,30.06 51.82,29.08 53.34,27.56 53.34,21.59 54.4,20.53 v55.93,20.53
  Bottom 0.254: v62.76,20.32 61.24,18.8 57.66,18.8 v55.93,20.53
SCK  (via drill 0.51)
  Top 0.254: U2.9 66.1,15.37 66.14,15.41 67.6,15.41 67.92,15.73 67.92,18.5 66.62,19.8 v65.81,19.8
  Bottom 0.254: v65.81,19.8 66.28,19.8 67.69,21.21 67.69,27.43 63.12,32 58.29,32 57.85,32.45 JP6.3
SCL  (via drill 0.51)
  Top 0.254: v53.85,31.11 53.85,32 52.58,33.27 52.56,33.27 JP4.2 | U2.18 v58.67,17.15 v58.67,17.14
  Bottom 0.254: v58.67,17.14 58.67,17.65 58.29,18.03 55.88,18.03 55.12,18.8 55.12,26.8 54.36,27.56 54.36,30.61 v53.85,31.11
SDA  (via drill 0.51)
  Top 0.254: v52.2,31.37 52.2,31.88 49.28,34.8 48.49,34.8 JP4.3 | U2.19 57.88,17.49 v57.53,17.14
  Bottom 0.254: v57.53,17.14 57.15,17.53 55.63,17.53 54.61,18.54 54.61,26.42 53.72,27.3 53.72,29.84 v52.2,31.37
SGH  (via drill 0.51)
  Top 0.254: U1.4 41.13,24.02 38.23,26.92 34.04,26.92 33.27,26.16 33.27,24.64 33.91,24 C5.1 34.08,22.86 33.02,22.86 31.37,21.21 v31.37,19.81 | 29.05,14.7 29.59,15.24 30.48,15.24 31.37,16.13 v31.37,16.89
  Bottom 0.254: v31.37,19.81 v31.37,16.89
  other vias: 27.1,11.99 27.1,9.39 23.2,11.99 25.8,11.99 24.5,11.99 23.2,9.39 23.2,10.7 27.1,10.7 25.8,10.7 24.5,10.7 24.5,9.39 25.8,9.39
  pour Top (isolate 0.381, no thermals): 22.35,9.02 22.35,17.91 27.81,17.91 27.81,16.89 31.5,13.21 31.5,10.79 27.43,10.79 27.43,9.02
  pour Bottom (isolate 0.381): 6.86,5.97 21.84,5.97 21.84,15.37 32.77,15.37 32.77,0 6.86,0
VBAT  (via drill 0.51)
  Top 0.254: 28.95,18.79 28.6,19.14 | 5.53,30.2 4.88,30.84 4.88,31.75 4.5,32.12 C2.1
  Top 0.406: 7.47,25.32 8.74,25.32 Q5.2 | C4.2 33.23,28.03 31.5,26.29 27.56,26.29 26.67,25.4 | v27.1,19.43 28.32,19.43 28.95,18.79 29.58,18.16 31.24,18.16 34.92,14.48 36.07,14.48 37.21,13.34 38.61,13.34 38.99,13.72 38.99,15.62 40.39,17.02 41.53,17.02 42.45,17.94 U1.12 | U4.INPUT 7.92,35.87 6.73,34.67 6.73,33.15 5.84,32.26 4.55,32.26 C2.1
  other vias: 16.07,20.73 17.37,20.73 18.67,20.73 19.97,20.73 16.07,19.43 17.37,19.43 18.67,19.43 19.97,19.43 23.2,22.02 24.5,22.02 25.8,22.02 27.1,22.02 23.2,20.73 24.5,20.73 25.8,20.73 27.1,20.73 16.07,22.02 17.37,22.02 18.67,22.02 19.97,22.02 23.2,19.43 24.5,19.43 25.8,19.43
  pour Top (isolate 0.508, no thermals): 27.56,19.18 14.61,19.18 14.61,22.1 7.11,22.1 5.06,24.15 2.03,24.13 2.03,30.35 27.56,30.35
  pour Bottom (isolate 0.381): 32.77,16.51 32.77,26.92 0,26.92 0,16.51
VIN
  pour Top (isolate 0.381, no thermals): 1.78,22.86 1.78,17.27 10.16,17.27 10.16,21.34 6.6,21.34 5.08,22.86
VUSB  (via drill 0.51)
  Top 0.254: JP5.2 36.19,37.99 45.17,37.99 45.83,37.34 45.83,35.23 46.48,34.58 47.12,34.58 47.77,33.93 v47.77,33.45 | v68.25,7.93 69.88,9.56 69.88,26.65 68.28,28.25 v64.84,28.25 65.33,27.76 65.33,25.97 64.67,25.32 62.73,25.32 62.1,24.7 U$2.5V | 65.12,13.78 65.26,13.78 | 65.26,13.78 U2.7 | 65.26,13.78 67.44,13.78 v67.6,13.95
  Bottom 0.254: 68.25,7.77 v68.25,7.93 68.74,8.42 68.74,13.46 68.25,13.95 v67.6,13.95 | v64.84,28.25 64.84,28.73 62.73,30.84 57.54,30.84 56.24,32.15 49.08,32.15 v47.77,33.45

### Text on the board
tPlace: encoder | i2c | 1 | encoder | i2c | 5v | G | A | B | D | C | G | 1 | ICSP | ADDR SELECT | VBAT | BAT | GND | 330 | PiE | M+ | MOTOR | Q1-Q4 PSMN4R5 | 10k | M- | Grizzly Bear v1 | Rev. B (10-31-2012)